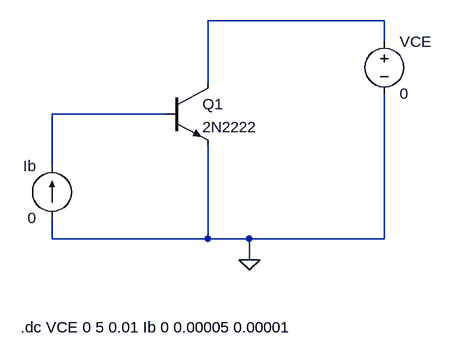
[diagram p0: schematic 1.1.1.asc]
1.1.1.asc, the LTspice schematic file:
Version 4
SHEET 1 880 680
WIRE 496 -16 224 -16
WIRE 496 16 496 -16
WIRE 224 80 224 -16
WIRE 160 128 -16 128
WIRE -16 208 -16 128
WIRE -16 320 -16 288
WIRE 224 320 224 176
WIRE 224 320 -16 320
WIRE 288 320 224 320
WIRE 496 320 496 96
WIRE 496 320 288 320
WIRE 288 352 288 320
FLAG 288 352 0
SYMBOL npn 160 80 R0
SYMATTR InstName Q1
SYMATTR Value 2N2222
SYMBOL voltage 496 0 R0
SYMATTR InstName VCE
SYMATTR Value 0
SYMBOL current -16 288 R180
WINDOW 0 24 80 Left 2
WINDOW 3 24 0 Left 2
SYMATTR InstName Ib
SYMATTR Value 0
TEXT -64 456 Left 2 !.dc VCE 0 5 0.01 Ib 0 0.00005 0.00001

The netlist it stands for:
* 1.1.1.asc
Q1 N001 N002 0 0 2N2222
VCE N001 0 0
Ib 0 N002 0
.model NPN NPN
.model PNP PNP
.lib standard.bjt
.dc VCE 0 5 0.01 Ib 0 0.00005 0.00001
.backanno
.end